# Altium schematic sheet PMOD-Type2-SPI.schdoc: TITRE
size Letter; ApprovedBy: APPROUVÉ PAR; Organization: Cegep Limoilou; Address1: 1300, 8e Avenue; Address2: Québec, QC; Address3: Canada; Address4: G1J 5L5; SheetNumber: 2; SheetTotal: 4
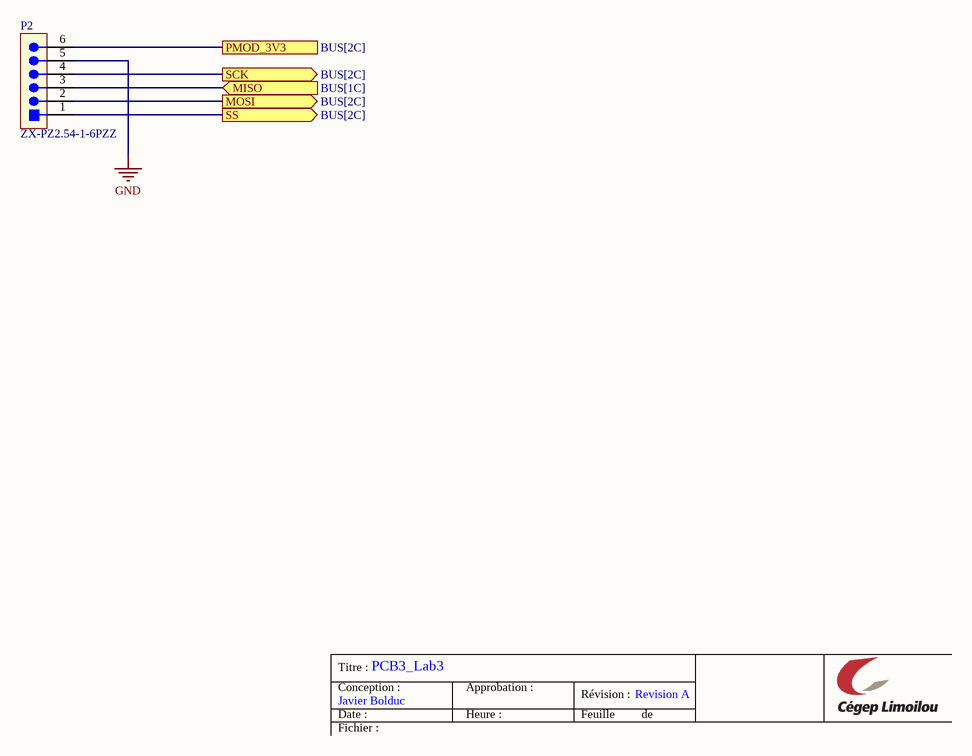
[diagram p0: PMOD-Type2-SPI.schdoc]

## Parts
P2  ZX-PZ2.54-1-6PZZ  [CONN_HDR_01X06_100MIL]  (no BOM)

## Ports
MISO (in, see BUS[1C]), MOSI (out, see BUS[2C]), PMOD_3V3 (see BUS[2C]), SCK (out, see BUS[2C]), SS (out, see BUS[2C])

## Nets
GND: P2.5
MISO: P2.3 ; port MISO
MOSI: P2.2 ; port MOSI
PMOD_3V3: P2.6 ; port PMOD_3V3
SCK: P2.4 ; port SCK
SS: P2.1 ; port SS

## Notes on the sheet
- Titre :
- Conception :
- Date :
- Javier Bolduc
- PCB3_Lab3
- Approbation :
- Heure :
- Révision :
- Feuille
- Revision A
- de
- Fichier :

## Library data of the parts
P2 = CONN-100MIL-HDR-01X06: Conn. Header 6pos 100mils; Manufacturer 1: Megastar; Mounting Technology: TH; Manufacturer Part Number 1: ZX-PZ2.54-1-6PZZ; Manufacturer 2: Würth Elektronik; Manufacturer Part Number 2: 61300611121; Supplier 1: LCSC; Supplier 2: Digikey; Supplier Part Number 2: 732-5319-ND; Supplier Part Number 1: C7501264